# Altium project power_board.PrjPcb (part 5 of 6)

## Sheet SensorsBat.SchDoc
size A4; SheetNumber: 8; SheetTotal: 9
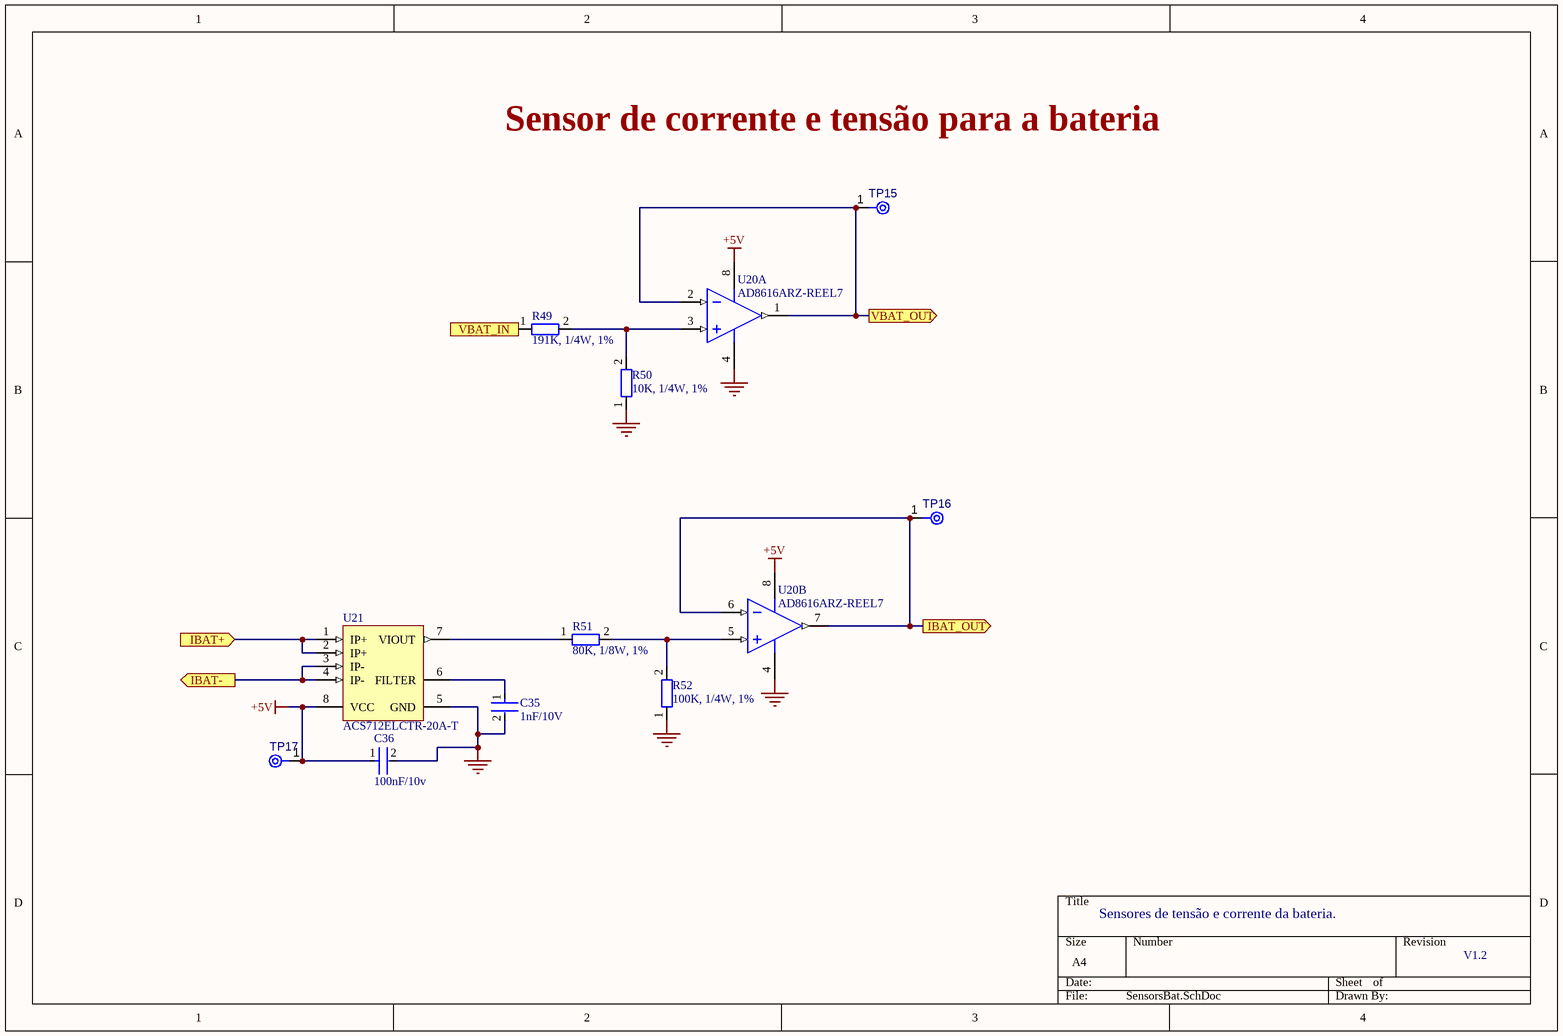
[diagram p6: SensorsBat.SchDoc]

### Parts
C35  1nF/10V  [FP-C0805C-DN-MFG]
C36  100nF/10v  [FP-C0805C-DN-MFG]
R49  191K, 1/4W, 1%  [RESC3216X60N]
R50  10K, 1/4W, 1%  [RES-0805]
R51  80K, 1/8W, 1%  [RES-0805]
R52  100K, 1/4W, 1%  [RES-0805]
TP15  TPAD6R  [TP06R]  (value not drawn)  (no BOM)
TP16  TPAD6R  [TP06R]  (value not drawn)  (no BOM)
TP17  TPAD6R  [TP06R]  (value not drawn)  (no BOM)
U20  AD8616ARZ-REEL7  [ADI-R-8_M]  (parts A,B of 2)
U21  ACS712ELCTR-20A-T  [ALEG-LC-8_V]

### Ports
IBAT+ (in), IBAT- (out), IBAT_OUT (out), VBAT_IN (in), VBAT_OUT (out)

### Nets
+5V: C36.1 TP17.1(TP) U20.8(+V) U21.8(VCC)
+12V: U21.3(IP-) U21.4(IP-) ; port IBAT-
GND: C35.2 C36.2 R50.1 R52.1 U20.4(-V) U21.5(GND)
IBAT: TP16.1(TP) U20.6(-IN_B) U20.7(OUT_B) ; port IBAT_OUT
VBAT: TP15.1(TP) U20.1(OUT_A) U20.2(-IN_A) ; port VBAT_OUT
NetC35_1: C35.1 U21.6(FILTER)
NetL2_2: R49.1 U21.1(IP+) U21.2(IP+) ; port IBAT+, port VBAT_IN
NetR49_2: R49.2 R50.2 U20.3(+IN_A)
NetR51_1: R51.1 U21.7(VIOUT)
NetR51_2: R51.2 R52.2 U20.5(+IN_B)

### Notes on the sheet
- Sensor de corrente e tensão para a bateria
- Sensores de tensão e corrente da bateria.
- V1.2

### Library data of the parts
C35 = CMP-2007-00247-2: CAP CER 1000PF 10V 10% X7R 0805; Manufacturer: KEMET; Manufacturer Part Number: C0805C102K8RACTU; Value: 1,000 pF; Temperature Coefficient: 30ppm/°C; Tolerance: 0.1; Material: Ceramic; ComponentLink2URL: https://content.kemet.com/datasheets/KEM_C1003_C0G_SMD.pdf; Ipc Land Pattern Name: CAPC200125X78; Mouser Description: Multilayer Ceramic Capacitors MLCC - SMD/SMT 10volts 1000pF X7R 10%; Voltage Rating: 10 V; RoHS: TRUE; Temperature Range High: +125°C; Temperature Characteristic: X7R; Digikey Description: CAP CER 1000PF 10V 10% X7R 0805; Lead Free: Yes; Automotive: No; Package: C0805C-DN; Category: Cap; Device Class L2: Capacitors; Temperature: -55°C to +125°C; Temperature Range Low: -55°C; Device Class L3: Ceramic Capacitors; Capacitance: 1,000 pF; ComponentLink2Description: Datasheet; Octopart: https://octopart.com/c0805c102k8ractu-kemet-16783731; Height: 0.88mm; Device Class L1: Passive Components; Supplier 1: Mouser; Supplier Part Number 1: 80-C0805C102K8R; Stock 1: 10223; Pricing 1: 1=0.30000, 10=0.15600, 50=0.15600, 100=0.09300, 1000=0.07300, 10000=0.05100 (USD); Mount: Surface Mount; Case/Package: 0805; Case Code (Metric): 2012; Case Code (Imperial): 0805; Contact Plating: Tin,Matte; Dielectric Material: Ceramic; Min Operating Temperature: -55°C; Max Operating Temperature: 125°C; Packaging: Tape and Reel; Package Quantity: 1; Voltage Rating (DC): 10V; Dielectric: X7R; Termination: SMD/SMT; Series: C; Construction: Flat; Length: 2mm; Width: 0.049inch; Thickness: 0.035inch; REACH SVHC: No SVHC; RoHS Compliant: Yes; ComponentLink1URL: http://www.mouser.com/ds/2/212/KEM_C1002_X7R_SMD-1102033.pdf?src-supplier=Mouser; ComponentLink1Description: http://www.mouser.com/ds/2/212/KEM_C1002_X7R_SMD-1102033.pdf?src-supplier=Mouser; ComponentLink3URL: https://search.kemet.com/component-edge/download/datasheet/C0805C102K8RACTU.pdf?src-supplier=Digi-Key; ComponentLink3Description: https://search.kemet.com/component-edge/download/datasheet/C0805C102K8RACTU.pdf?src-supplier=Digi-Key; ComponentLink4URL: https://api.kemet.com/component-edge/download/datasheet/C0805C102K8RACTU.pdf?src-supplier=Digi-Key; ComponentLink4Description: https://api.kemet.com/component-edge/download/datasheet/C0805C102K8RACTU.pdf?src-supplier=Digi-Key; ComponentLink5URL: http://capacitoredge.kemet.com/capedge2/DataSheet?pn=C0805C102K8RACTU&src-supplier=Avnet; ComponentLink5Description: http://capacitoredge.kemet.com/capedge2/DataSheet?pn=C0805C102K8RACTU&src-supplier=Avnet; ComponentLink6URL: http://www.farnell.com/datasheets/2627200.pdf?src-supplier=Newark; ComponentLink6Description: http://www.farnell.com/datasheets/2627200.pdf?src-supplier=Newark
C36 = CMP-1036-03808-3: CAP CER 10000PF 10V X7R 0805; Manufacturer Part Number: C0805C103K8RACTU; Manufacturer: KEMET; Material: Ceramic; Value: 10,000 pF; Temperature Coefficient: 30ppm/°C; Tolerance: 0.1; RoHS: TRUE; Lead Free: Yes; Temperature: -55°C to +125°C; Device Class L2: Capacitors; Temperature Characteristic: X7R; Device Class L1: Passive Components; Mouser Description: Multilayer Ceramic Capacitors MLCC - SMD/SMT 10volts 10000pF X7R 10%; Category: Cap; Ipc Land Pattern Name: CAPC200125X78; Height: 0.88mm; ComponentLink2URL: https://content.kemet.com/datasheets/KEM_C1003_C0G_SMD.pdf; Capacitance: 10,000 pF; Temperature Range High: +125°C; Automotive: No; ComponentLink2Description: Datasheet; Octopart: https://octopart.com/c0805c103k8ractu-kemet-12595572; Device Class L3: Ceramic Capacitors; Temperature Range Low: -55°C; Package: C0805C-DN; Voltage Rating: 10 V; Digikey Description: CAP CER 10000PF 10V X7R 0805; Supplier 1: Mouser; Supplier Part Number 1: 80-C0805C103K8R; Stock 1: 7669; Pricing 1: 1=0.18000, 10=0.07300, 50=0.07300, 100=0.06000, 1000=0.04500, 10000=0.04500 (USD); Mount: Surface Mount; Case/Package: 0805; Case Code (Metric): 2012; Case Code (Imperial): 0805; Dielectric Material: Ceramic; Min Operating Temperature: -55°C; Max Operating Temperature: 125°C; Packaging: Tape and Reel; Package Quantity: 4000; Voltage Rating (DC): 10V; Dielectric: X7R; Termination: SMD/SMT; Series: C; Length: 2mm; Width: 0.049inch; Thickness: 0.035inch; Lead Pitch: 0.75mm; Depth: 1.25mm; RoHS Compliant: Yes; ComponentLink1URL: https://datasheet.ciiva.com/5422/kem-c1002-x7r-smd-357932-5422870.pdf?src-supplier=Mouser; ComponentLink1Description: https://datasheet.ciiva.com/5422/kem-c1002-x7r-smd-357932-5422870.pdf?src-supplier=Mouser
R49 = RES-1206: Res Thick Film 1206 191K Ohm 1% 0.25W(1/4W) ±100ppm/C Molded SMD Paper T/R; Manufacturer: Yageo; Manufacturer Part Number: RC1206FR-07191KL; Resistance: 191kR; Temperature Coefficient: 100ppm/°C; Power Rating: 250mW; Voltage Rating: 200V; Supplier 1: Mouser; Supplier Part Number 1: 603-RC1206FR-07191KL; RoHS: Yes; Category: Chip SMD Resistors; Stock 1: 10616; Pricing 1: 1=0.23000, 10=0.05400, 50=0.05400, 100=0.01900, 1000=0.01400, 10000=0.00800 (USD); Case/Package: 1206; Contact Plating: Tin,Matte; Case Code (Imperial): 1206; Case Code (Metric): 3216; Weight: 0.000571oz; Min Operating Temperature: -55°C; Max Operating Temperature: 155°C; Tolerance: 1%; Resistor Type: Thick Film; Packaging: Tape and Reel; Termination: SMD/SMT; Voltage Rating (DC): 200V; Features: Moisture Resistant; Series: RC; Max Power Dissipation: 250mW; Number of Terminations: 2; Construction: Rectangular; Length: 3.2mm; Width: 1.6mm; Height: 0.55mm; Depth: 1.6mm; Radiation Hardening: No; Military Standard: Not; Lead Free: Lead Free; RoHS Compliant: Yes; ComponentLink1URL: http://www.mouser.com/ds/2/447/PYu-RC1206_51_RoHS_L-4-349080.pdf?src-supplier=Mouser; ComponentLink1Description: http://www.mouser.com/ds/2/447/PYu-RC1206_51_RoHS_L-4-349080.pdf?src-supplier=Mouser; ComponentLink2URL: http://components.arrow.com/part/dataview/0323_00047427?src-supplier=Arrow+Europe; ComponentLink2Description: http://components.arrow.com/part/dataview/0323_00047427?src-supplier=Arrow+Europe; ComponentLink3URL: http://www.yageo.com/documents/recent/PYu-RC_Group_51_RoHS_L_2.pdf?src-supplier=Avnet; ComponentLink3Description: http://www.yageo.com/documents/recent/PYu-RC_Group_51_RoHS_L_2.pdf?src-supplier=Avnet; ComponentLink4URL: http://www.yageo.com.tw/exep/pages/download/literatures/PYu-R_INT-thick_7.pdf?src-supplier=Digi-Key; ComponentLink4Description: http://www.yageo.com.tw/exep/pages/download/literatures/PYu-R_INT-thick_7.pdf?src-supplier=Digi-Key; ComponentLink5URL: http://www.yageo.com/documents/recent/PYu-RC_Group_51_RoHS_L_9.pdf?src-supplier=Digi-Key; ComponentLink5Description: http://www.yageo.com/documents/recent/PYu-RC_Group_51_RoHS_L_9.pdf?src-supplier=Digi-Key; ComponentLink6URL: http://www.yageo.com/documents/recent/PYu-RC_Group_51_RoHS_L_10.pdf?src-supplier=Digi-Key; ComponentLink6Description: http://www.yageo.com/documents/recent/PYu-RC_Group_51_RoHS_L_10.pdf?src-supplier=Digi-Key; ComponentLink7URL: http://www.yageo.com/documents/recent/PYu-RC1206_51_RoHS_L_5.pdf?src-supplier=Avnet+Europe; ComponentLink7Description: http://www.yageo.com/documents/recent/PYu-RC1206_51_RoHS_L_5.pdf?src-supplier=Avnet+Europe
R50 = Res-0805: Res Thick Film 2.0 x 1.2 mm 10K Ohm 1% 0.125W(1/8W) 100ppm/ C Molded SMD Paper T/R; Manufacturer_Name: YAGEO (PHYCOMP); Manufacturer_Part_Number: RC0805JR-131KL; Manufacturer: Yageo; Manufacturer Part Number: RC0805FR-1310KL; Resistance: 10kR; Temperature Coefficient: 100ppm/°C; Power Rating: 125mW; Voltage Rating: 150V; Datasheet Link: http://www.yageo.com/documents/recent/PYu-RC_Group_51_RoHS_L_10.pdf; Height: 0.6mm; Mouser Part Number: 603-RC0805JR-131KL; Mouser Price/Stock: https://www.mouser.com/Search/Refine.aspx?Keyword=603-RC0805JR-131KL; Supplier 1: Mouser; Supplier Part Number 1: 603-RC0805FR-1310KL; RoHS: Yes; Category: Chip SMD Resistors; Stock 1: 16417; Pricing 1: 1=0.13000, 10=0.03100, 50=0.03100, 100=0.01100, 1000=0.00800, 10000=0.00500 (USD); Case/Package: 0805; Number of Pins: 2; Contact Plating: Tin,Matte,Lead; Case Code (Imperial): 0805; Case Code (Metric): 2012; Min Operating Temperature: -55°C; Max Operating Temperature: 155°C; Tolerance: 1%; Resistor Type: Thick Film; Packaging: Tape and Reel; Termination: SMD/SMT; Voltage Rating (DC): 150V; Series: RC; Resistance Tolerance: 1%; Radiation Hardening: No; REACH SVHC: No SVHC; Lead Free: Lead Free; RoHS Compliant: Yes; ComponentLink1URL: http://www.farnell.com/datasheets/2167052.pdf?src-supplier=Farnell; ComponentLink1Description: http://www.farnell.com/datasheets/2167052.pdf?src-supplier=Farnell; ComponentLink2URL: http://www.mouser.com/ds/2/447/Yageo_08112016_RC0805-968729.pdf?src-supplier=Mouser; ComponentLink2Description: http://www.mouser.com/ds/2/447/Yageo_08112016_RC0805-968729.pdf?src-supplier=Mouser; ComponentLink3URL: http://components.arrow.com/part/dataview/0323_00200993?src-supplier=Arrow+Europe; ComponentLink3Description: http://components.arrow.com/part/dataview/0323_00200993?src-supplier=Arrow+Europe; ComponentLink4URL: http://www.yageo.com/pdf/PYu-RC0805_51_RoHS_L_4.pdf?src-supplier=Avnet; ComponentLink4Description: http://www.yageo.com/pdf/PYu-RC0805_51_RoHS_L_4.pdf?src-supplier=Avnet; ComponentLink5URL: http://www.yageo.com/documents/recent/PYu-RC0805_51_RoHS_L_5.pdf?src-supplier=Avnet+Europe; ComponentLink5Description: http://www.yageo.com/documents/recent/PYu-RC0805_51_RoHS_L_5.pdf?src-supplier=Avnet+Europe; ComponentLink6URL: http://www.farnell.com/datasheets/2167052.pdf?src-supplier=Element14; ComponentLink6Description: http://www.farnell.com/datasheets/2167052.pdf?src-supplier=Element14; ComponentLink7URL: http://www.farnell.com/datasheets/2167052.pdf?src-supplier=Newark; ComponentLink7Description: http://www.farnell.com/datasheets/2167052.pdf?src-supplier=Newark
R51 = Res-0805: RES SMD 80.6K OHM 1% 1/8W 0805; Manufacturer_Name: YAGEO (PHYCOMP); Manufacturer_Part_Number: RC0805JR-131KL; Manufacturer: Yageo; Manufacturer Part Number: RC0805FR-0780K6L; Resistance: 80.6kR; Power Rating: 125mW; Voltage Rating: 150V; Temperature Coefficient: 100ppm/°C; Datasheet Link: http://www.yageo.com/documents/recent/PYu-RC_Group_51_RoHS_L_10.pdf; Height: 0.6mm; Mouser Part Number: 603-RC0805JR-131KL; Mouser Price/Stock: https://www.mouser.com/Search/Refine.aspx?Keyword=603-RC0805JR-131KL; Supplier 1: Mouser; Supplier Part Number 1: 603-RC0805FR-0780K6L; RoHS: Yes; Category: Chip SMD Resistors; Stock 1: 25105; Pricing 1: 1=0.13000, 10=0.03100, 50=0.03100, 100=0.01100, 1000=0.00800, 10000=0.00500 (USD); Mount: Surface Mount; Case/Package: 0805; Case Code (Metric): 2012; Case Code (Imperial): 0805; Size Code: 0805; Min Operating Temperature: -55°C; Max Operating Temperature: 155°C; Tolerance: 1%; Package Quantity: 1; Packaging: Tape and Reel; Resistor Type: Thick Film; Number of Terminations: 2; Termination: SMD/SMT; Max Power Dissipation: 125mW; Voltage Rating (DC): 150V; Features: Moisture Resistant; Series: RC; Technology: THICK FILM; Length: 0.079inch; Width: 0.049inch; Depth: 1.25mm; Lead Free: Lead Free; RoHS Compliant: Yes; ComponentLink1URL: https://datasheet.ciiva.com/11819/0900766b8106beab-11819866.pdf?src-supplier=RSComponents; ComponentLink1Description: https://datasheet.ciiva.com/11819/0900766b8106beab-11819866.pdf?src-supplier=RSComponents; ComponentLink2URL: https://datasheet.ciiva.com/2457/pyu-r-int-thick-7-2457257.pdf?src-supplier=Digi-Key; ComponentLink2Description: https://datasheet.ciiva.com/2457/pyu-r-int-thick-7-2457257.pdf?src-supplier=Digi-Key; ComponentLink3URL: https://datasheet.ciiva.com/2457/pyu-r-int-thick-7-2457258.pdf?src-supplier=Digi-Key; ComponentLink3Description: https://datasheet.ciiva.com/2457/pyu-r-int-thick-7-2457258.pdf?src-supplier=Digi-Key; ComponentLink4URL: https://datasheet.ciiva.com/2457/pyu-r-int-thick-7-2457259.pdf?src-supplier=Digi-Key; ComponentLink4Description: https://datasheet.ciiva.com/2457/pyu-r-int-thick-7-2457259.pdf?src-supplier=Digi-Key; ComponentLink5URL: https://datasheet.ciiva.com/12667/rc0805-12667964.pdf?src-supplier=Mouser; ComponentLink5Description: https://datasheet.ciiva.com/12667/rc0805-12667964.pdf?src-supplier=Mouser
R52 = Res-0805: Thick Film Resistors 100K OHM 1%; Manufacturer_Name: YAGEO (PHYCOMP); Manufacturer_Part_Number: RC0805JR-131KL; Manufacturer: Yageo; Manufacturer Part Number: RC0805FR-13100KL; Resistance: 100kR; Temperature Coefficient: 100ppm/°C; Power Rating: 125mW; Voltage Rating: 150V; Datasheet Link: http://www.yageo.com/documents/recent/PYu-RC_Group_51_RoHS_L_10.pdf; Height: 0.6mm; Mouser Part Number: 603-RC0805JR-131KL; Mouser Price/Stock: https://www.mouser.com/Search/Refine.aspx?Keyword=603-RC0805JR-131KL; Supplier 1: Mouser; Supplier Part Number 1: 603-RC0805FR-13100KL; RoHS: Yes; Category: Chip SMD Resistors; Stock 1: 57591; Pricing 1: 1=0.13000, 10=0.03100, 50=0.03100, 100=0.01100, 1000=0.00800, 10000=0.00500 (USD); Case/Package: 0805; Contact Plating: Tin,Lead,Matte; Case Code (Imperial): 0805; Case Code (Metric): 2012; Size Code: 0805; Min Operating Temperature: -55°C; Max Operating Temperature: 155°C; Tolerance: 1%; Resistor Type: Thick Film; Packaging: Tape and Reel; Termination: SMD/SMT; Series: RC; Radiation Hardening: No; Lead Free: Lead Free; RoHS Compliant: Yes; ComponentLink1URL: https://datasheet.ciiva.com/5558/rc0805-5558047.pdf?src-supplier=Mouser; ComponentLink1Description: https://datasheet.ciiva.com/5558/rc0805-5558047.pdf?src-supplier=Mouser
TP15-TP17 = CMP-00028-00002-2: 0.6mm round; Pins: 1
U20 = CMP-0384-00618-1: Double Channel Wide Bandwidth Operational Amplifier, 24 MHz BW, 12 V/us SR, Industrial, 8-pin SOIC (R-8), Reel; Generic Part Number: AD8616; Manufacturer: Analog Devices; Amplifiers Per Package: 2; Iq/Amp: 2mA; Small Signal Bandwidth: 24MHz; V Span Max: 6V; Input Offset Voltage: 23uV; Input Bias Current: 200fA; V Span Min: 2.7V; Slew Rate: 12V/us; ComponentLink2Description: Datasheet; ComponentLink1URL: http://www.analog.com/en/index.html; PackageDescription: 8-Pin Standard Small Outline Package, Body 3.9 x 4.9 mm, Pitch 1.27 mm; Code_JEDEC: MS-012-AA; PackageReference: R-8; Mounting Technology: Surface Mount; ComponentLink2URL: http://www.analog.com/static/imported-files/data_sheets/AD8615_8616_8618.pdf; ComponentLink3Description: Package Specification; PackageVersion: 060506-A; ComponentLink1Description: Manufacturer URL; ComponentLink3URL: http://www.analog.com/static/imported-files/packages/PKG_PDF/SOIC_Narrow%20(R)/R_8.pdf; DatasheetVersion: Rev. E; PartNumber: AD8616ARZ-REEL7
U21 = CMP-0826-00001-1: Linear Current Sensor IC, 4.5 to 5.5 V Supply Voltage, 10 mA Supply Current, -40 to 85 degC, 8-Pin SOIC (LC), RoHS, Tape and Reel; Manufacturer: Allegro Microsystems; CLOAD: 10 nF Max.; ICC: 10 mA; F: 80 kHz; RLOAD: 4.7 kOhm Min.; Optimized Accuracy Range: +/- 20 A; TR: 3.5 us; Sensitivity Sens: 100 mV/A Typ.; Operating Temperature Range: -40 to 85 degC; ComponentLink2URL: http://www.allegromicro.com/~/media/Files/Datasheets/ACS712-Datasheet.ashx; ComponentLink1Description: Manufacturer URL; VCC: 4.5 to 5.5 V; Mounting Technology: Surface Mount; DatasheetVersion: Rev. 15; ComponentLink2Description: Datasheet; ComponentLink1URL: http://www.allegromicro.com/; PackageDescription: 8-Pin SOIC, Body 4.9 x 3.9 mm, Pitch 1.27 mm; PackageReference: LC-8; RoHS: TRUE; Packing: Tape and Reel; PartNumber: ACS712ELCTR-20A-T

## Sheet charge_controller.SchDoc
size A4; SheetNumber: 4; SheetTotal: 9
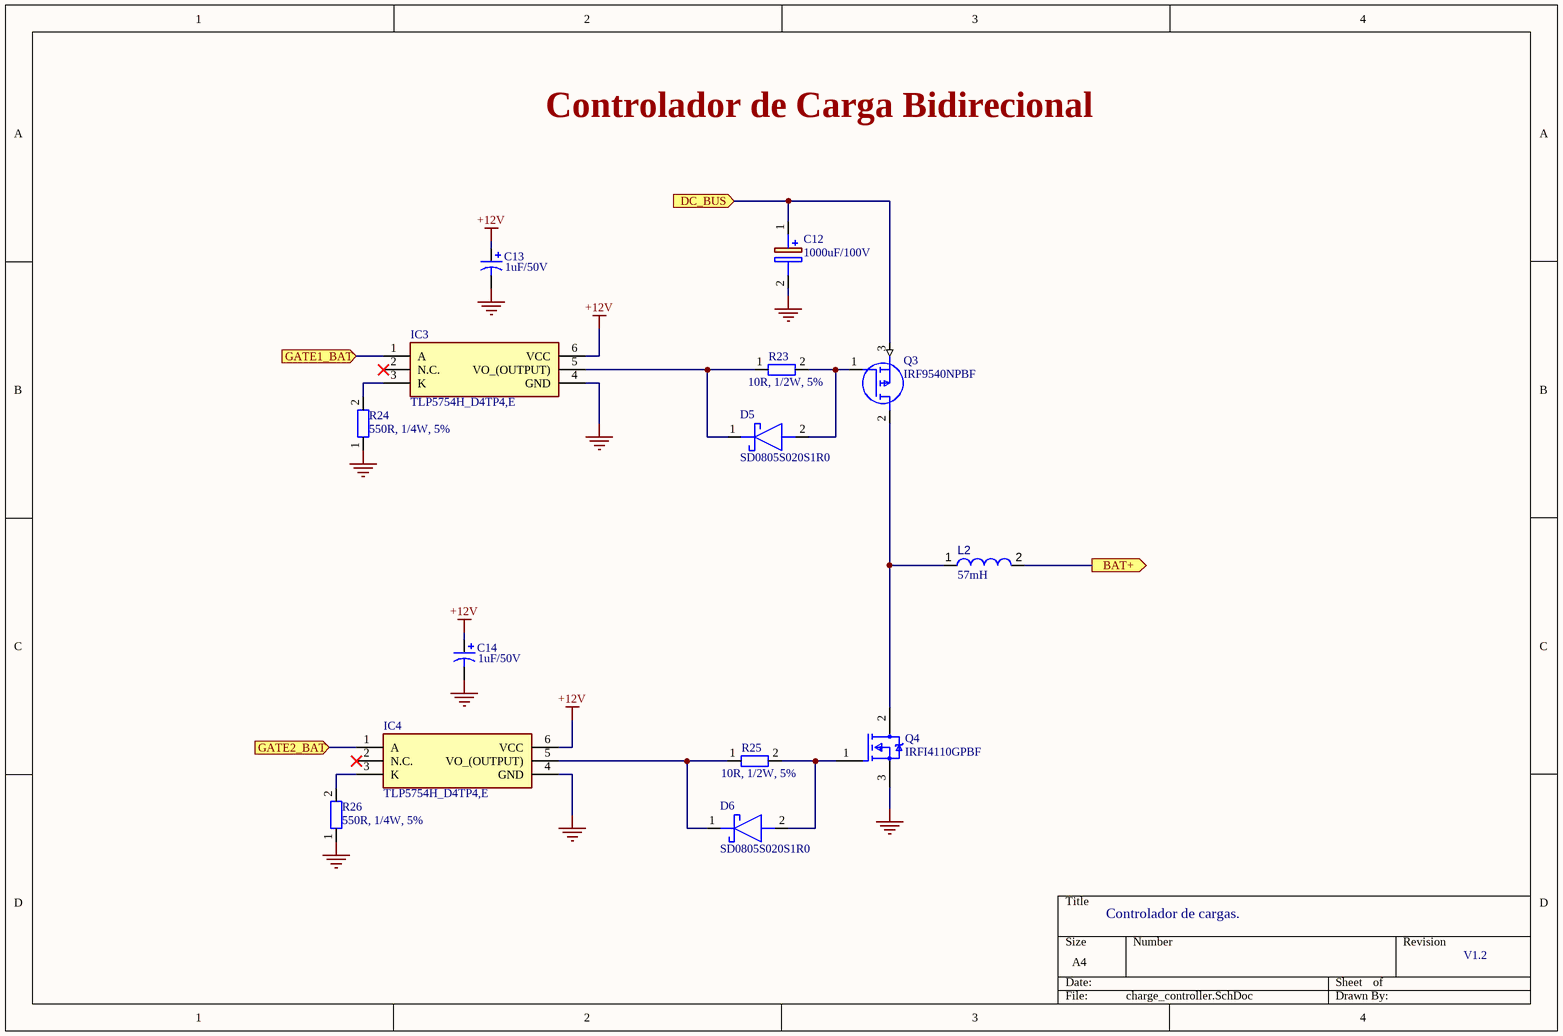
[diagram p7: charge_controller.SchDoc]

### Parts
C12  1000uF/100V  [CAPPRD750W85D1800H3750]
C13  value 1uF/50V  [C1206]  (hidden comment: Cap Pol1)
C14  value 1uF/50V  [C1206]  (hidden comment: Cap Pol1)
D5  SD0805S020S1R0  [DIOM1613X100N]
D6  SD0805S020S1R0  [DIOM1613X100N]
IC3  TLP5754H_D4TP4,E  [SOIC127P1105X230-6N]
IC4  TLP5754H_D4TP4,E  [SOIC127P1105X230-6N]
L2  value 57mH  [INDR62-500-1100X850X1100]  (hidden comment: RL622-101K-RC)
Q3  IRF9540NPBF  [TO254P469X1042X1967-3P]
Q4  IRFI4110GPBF  [FP-PG-TO220-3-MFG]
R23  10R, 1/2W, 5%  [RES-0805]
R24  550R, 1/4W, 5%  [RES-0805]
R25  10R, 1/2W, 5%  [RES-0805]
R26  550R, 1/4W, 5%  [RES-0805]

### Ports
BAT+ (out), DC_BUS (in), GATE1_BAT (in), GATE2_BAT (in)

### Nets
+12V: C13.1 C14.1 IC3.6(VCC) IC4.6(VCC)
GND: C12.2(-) C13.2 C14.2 IC3.4(GND) IC4.4(GND) Q4.3(SOURCE) R24.1 R26.1
DC BUS: C12.1(+) Q3.3(S) ; port DC_BUS
NetD5_1: D5.1(K) IC3.5(VO_(OUTPUT)) R23.1
NetD5_2: D5.2(A) Q3.1(G) R23.2
NetD6_1: D6.1(K) IC4.5(VO_(OUTPUT)) R25.1
NetD6_2: D6.2(A) Q4.1(GATE) R25.2
NetIC3_1: IC3.1(A) ; port GATE1_BAT
NetIC3_3: IC3.3(K) R24.2
NetIC4_1: IC4.1(A) ; port GATE2_BAT
NetIC4_3: IC4.3(K) R26.2
NetL2_1: L2.1 Q3.2(D) Q4.2(DRAIN)
NetL2_2: L2.2 ; port BAT+

Not connected (* = marked no-connect by the designer): IC3 2(N.C.)*; IC4 2(N.C.)*

### Notes on the sheet
- Controlador de Carga Bidirecional
- Controlador de cargas.
- V1.2

### Library data of the parts
C12 = ECA-2AHG102: Aluminum Electrolytic Capacitors - Leaded 1000uF 100V; Manufacturer_Name: Panasonic; Capacitance: 1mF; Tolerance: 20%; Ripple Current: 985mA; Leakage Current: 3uA; Life (Hours): 2000Hour; Dissipation Factor: 0.08%; Lead/Base Style: Straight; Lead Diameter: 0.8mm; Datasheet Link: http://www.mouser.com/ds/2/315/ABA0000C1215-1109177.pdf; Height: 37.5mm; Manufacturer_Part_Number: ECA-2AHG102; Mouser Part Number: 667-ECA-2AHG102; Mouser Price/Stock: https://www.mouser.co.uk/ProductDetail/Panasonic/ECA-2AHG102/?qs=rrcJgg%2Fw9KxYcZZHtVYgiQ%3D%3D; Arrow Part Number: ECA-2AHG102; Arrow Price/Stock: https://www.arrow.com/en/products/eca-2ahg102/panasonic; Supplier 1: Mouser; Supplier Part Number 1: 667-ECA-2AHG102; Manufacturer: Panasonic; Manufacturer Part Number: ECA-2AHG102; RoHS: Yes; Category: Aluminum Electrolytic Capacitors; Stock 1: 994; Pricing 1: 1=2.62000, 10=1.75000, 50=1.75000, 100=1.60000, 1000=1.07000, 10000=1.07000 (USD); Mount: Through Hole,PCB; Case/Package: Radial; Number of Pins: 2; Contact Plating: Tin; Min Operating Temperature: -55°C; Max Operating Temperature: 105°C; Termination: Radial; Voltage Rating: 100V; Packaging: Bulk; Package Quantity: 50; Voltage Rating (DC): 100V; Voltage: 100V; Series: NHG; Construction: RADIAL; Diameter: 18mm; Length: 35.5mm; Width: 18mm; Lead Pitch: 7.5mm; Height - Seated (Max): 1.476inch; Radiation Hardening: No; REACH SVHC: No SVHC; Lead Free: Lead Free; RoHS Compliant: Yes; ComponentLink1URL: https://datasheet.ciiva.com/2984/aba0000ce26-2984390.pdf?src-supplier=Avnet; ComponentLink1Description: https://datasheet.ciiva.com/2984/aba0000ce26-2984390.pdf?src-supplier=Avnet; ComponentLink2URL: https://datasheet.ciiva.com/43459/1790596-43459676.pdf?src-supplier=Farnell; ComponentLink2Description: https://datasheet.ciiva.com/43459/1790596-43459676.pdf?src-supplier=Farnell; ComponentLink3URL: https://datasheet.ciiva.com/24027/aba0000ce26-372437-24027279.pdf?src-supplier=Mouser; ComponentLink3Description: https://datasheet.ciiva.com/24027/aba0000ce26-372437-24027279.pdf?src-supplier=Mouser; ComponentLink4URL: https://datasheet.ciiva.com/30158/8aba0000ce26-30158524.pdf?src-supplier=Onlinecomponents.com; ComponentLink4Description: https://datasheet.ciiva.com/30158/8aba0000ce26-30158524.pdf?src-supplier=Onlinecomponents.com; ComponentLink5URL: https://datasheet.ciiva.com/16387/aba0000ce26-16387053.pdf?src-supplier=Future+Electronics; ComponentLink5Description: https://datasheet.ciiva.com/16387/aba0000ce26-16387053.pdf?src-supplier=Future+Electronics; ComponentLink6URL: https://datasheet.ciiva.com/14594/70067776-14594090.pdf?src-supplier=Allied+Electronics; ComponentLink6Description: https://datasheet.ciiva.com/14594/70067776-14594090.pdf?src-supplier=Allied+Electronics; ComponentLink7URL: https://datasheet.ciiva.com/15198/getdatasheetpartid-470872-15198006.pdf?src-supplier=Verical; ComponentLink7Description: https://datasheet.ciiva.com/15198/getdatasheetpartid-470872-15198006.pdf?src-supplier=Verical; ComponentLink8URL: https://datasheet.ciiva.com/17533/aba0000ce26-17533421.pdf?src-supplier=Avnet+Europe; ComponentLink8Description: https://datasheet.ciiva.com/17533/aba0000ce26-17533421.pdf?src-supplier=Avnet+Europe; ComponentLink9URL: https://datasheet.ciiva.com/29248/792491-da-01-en-elko-nhg-r-1000uf-100v-105c-29248620.pdf?src-supplier=Conrad; ComponentLink9Description: https://datasheet.ciiva.com/29248/792491-da-01-en-elko-nhg-r-1000uf-100v-105c-29248620.pdf?src-supplier=Conrad
C13 C14 = Cap Pol1: KEMET         T491A105K050AT            Surface Mount Tantalum Capacitor, T491 Series, 1 F,  10%, 50 V, 1206 [3216 Metric], A; Capacitance: 1uF; ESR (Equivalent Series Resistance): 7R; Voltage Rating: 50V; Polarity: Polar; Dissipation Factor: 4%; Published: 8-Jun-2000; LatestRevisionDate: 17-Jul-2002; LatestRevisionNote: Re-released for DXP Platform.; PackageReference: RB7.6-15; Publisher: Altium Limited; PackageDescription: Polarized Capacitor (Radial); 2 Leads; Supplier 1: Mouser; Supplier Part Number 1: 80-T491A105K050AT; Manufacturer: KEMET; Manufacturer Part Number: T491A105K050AT; RoHS: Yes; Category: Tantalum Capacitors; Stock 1: 5526; Pricing 1: 1=0.86000, 10=0.53600, 50=0.53600, 100=0.37800, 1000=0.31600, 10000=0.24700 (USD); Case/Package: Molded; Case Code (Metric): 3216; Case Code (Imperial): 1206; Min Operating Temperature: -55°C; Max Operating Temperature: 125°C; Tolerance: 10%; Packaging: Cut Tape; Voltage Rating (DC): 50V; Length: 3.2mm; Depth: 1.6mm; REACH SVHC: No SVHC; Lead Free: Lead Free; RoHS Compliant: Yes; ComponentLink1URL: https://datasheet.ciiva.com/7972/1854511-7972911.pdf?src-supplier=Element14; ComponentLink1Description: https://datasheet.ciiva.com/7972/1854511-7972911.pdf?src-supplier=Element14
D5 D6 = SD0805S020S1R0: Schottky Diodes & Rectifiers 20volts 1A SIZE 0805; Manufacturer_Name: AVX; Manufacturer: Kyocera AVX; Max Surge Current: 10A; Forward Voltage: 450mV; Max Reverse Current: 200uA; Max Repetitive Reverse Voltage (Vrrm): 20V; Element Configuration: Single; Datasheet Link: https://componentsearchengine.com/Datasheets/1/SD0805S020S1R0.pdf; Height: 1mm; Manufacturer_Part_Number: SD0805S020S1R0; Mouser Part Number: 581-SD0805S020S1R0; Mouser Price/Stock: https://www.mouser.co.uk/ProductDetail/AVX/SD0805S020S1R0/?qs=jCA%252BPfw4LHbpkAoSnwrdjw%3D%3D; Arrow Part Number: SD0805S020S1R0; Arrow Price/Stock: https://www.arrow.com/en/products/sd0805s020s1r0/avx; Supplier 1: Mouser; Supplier Part Number 1: 581-SD0805S020S1R0; Manufacturer Part Number: SD0805S020S1R0; RoHS: Yes; Category: Rectifier Diodes; Stock 1: 14821; Pricing 1: 1=0.38000, 10=0.29100, 50=0.29100, 100=0.17800, 1000=0.11300, 10000=0.08700 (USD); Mount: Surface Mount; Case/Package: 0805; Number of Pins: 2; Case Code (Metric): 2012; Case Code (Imperial): 0805; Min Operating Temperature: -55°C; Max Operating Temperature: 125°C; Packaging: Tape and Reel; Package Quantity: 3000; Forward Current: 1A; Average Rectified Current: 1A; Max Reverse Leakage Current: 200uA; Max Forward Surge Current (Ifsm): 10A; Peak Non-Repetitive Surge Current: 10A; Max Reverse Voltage (DC): 20V; Series: -; Radiation Hardening: No; REACH SVHC: No SVHC; RoHS Compliant: Yes; ComponentLink1URL: https://datasheet.ciiva.com/29883/schottky-29883740.pdf?src-supplier=Avnet; ComponentLink1Description: https://datasheet.ciiva.com/29883/schottky-29883740.pdf?src-supplier=Avnet; ComponentLink2URL: https://datasheet.ciiva.com/29883/schottky-29883741.pdf?src-supplier=Avnet; ComponentLink2Description: https://datasheet.ciiva.com/29883/schottky-29883741.pdf?src-supplier=Avnet; ComponentLink3URL: https://datasheet.ciiva.com/13084/schottky-221155-13084174.pdf?src-supplier=Mouser; ComponentLink3Description: https://datasheet.ciiva.com/13084/schottky-221155-13084174.pdf?src-supplier=Mouser
IC3 IC4 = TLP5754H_D4TP4,E: Integrated Circuit; Manufacturer_Name: Toshiba; Manufacturer_Part_Number: TLP5754H(D4TP4,E; Datasheet Link: https://toshiba.semicon-storage.com/; Height: 2.3mm; Mouser Part Number: 757-TLP5754HD4TP4E; Mouser Price/Stock: https://www.mouser.co.uk/ProductDetail/Toshiba/TLP5754HD4TP4E?qs=BJlw7L4Cy78tX5u9MwNqOg%3D%3D; Supplier 1: Mouser; Supplier Part Number 1: 757-TLP5754HD4TP4E; Manufacturer: Toshiba; Manufacturer Part Number: TLP5754H(D4TP4,E; RoHS: Yes; Stock 1: 2749; Pricing 1: 1=2.13000, 10=1.86000, 50=1.83000, 100=1.09000, 1000=0.95600, 10000=0.73200 (USD)
L2 = CMP-006-00013-6: Radial Inductor, 100 uH, +/- 10%, 0.91 A, -55 to 105 degC, 2-Pin THD, RoHS, Bulk; Manufacturer: Bourns; Q Factor: 20; Shielding: Unshielded; Core Material: Ferrite; Self Resonant Frequency: 3.7MHz; Resistance: 0.28Ohm; Current Rating: 910mA; Datasheet URL: http://www.bourns.com/docs/Product-Datasheets/rl622_series.pdf; Pins: 2; Inductance Tolerance: 10%; Packaging: Bulk; Tolerance: 10%; Diameter: 8.5mm; RoHS Compliant: True; Max Operating Temperature: 105°C; Package Quantity: 100; Package Reference: INDR62-500-1100X850X1100; Mounting Technology: TH; Lead Pitch: 5mm; Datasheet Version: Aug-10; Min Operating Temperature: -55°C; Package Description: 2-Pin Radial Lead, Dia 8.5 mm, Pitch 5 mm; Case/Package: Radial
Q3 = IRF9540NPBF: Mosfet, Power; P-ch; Vdss -100V; Rds(on) 0.117 Ohm; Id -23A; TO-220AB; Pd 140W; Vgs +/-2; Manufacturer_Name: Infineon; Manufacturer: International Rectifier; Rise Time: 67ns; Gate to Source Voltage (Vgs): 20V; Continuous Drain Current (ID): 23A; Turn-On Delay Time: 15ns; Turn-Off Delay Time: 51ns; Rds On Max: 117mR; Input Capacitance: 1.3nF; Drain to Source Voltage (Vdss): 100V; Element Configuration: Single; Recovery Time: 220ns; Nominal Vgs: -4V; Number of Elements: 1; Datasheet Link: https://www.infineon.com/dgdl/irf9540npbf.pdf?fileId=5546d462533600a401535611cfa21dc8; Height: 4.69mm; Manufacturer_Part_Number: IRF9540NPBF; Mouser Part Number: 942-IRF9540NPBF; Mouser Price/Stock: https://www.mouser.co.uk/ProductDetail/Infineon-IR/IRF9540NPBF?qs=9%252BKlkBgLFf0vnuA8mxUPtw%3D%3D; Arrow Part Number: IRF9540NPBF; Arrow Price/Stock: https://www.arrow.com/en/products/irf9540npbf/infineon-technologies-ag; Supplier 1: Mouser; Supplier Part Number 1: 942-IRF9540NPBF; Manufacturer Part Number: IRF9540NPBF; RoHS: Yes; Category: MOSFETs; Stock 1: 1219; Pricing 1: 1=1.17000, 10=0.96200, 50=0.96200, 100=0.74900, 1000=0.51600, 10000=0.45300 (USD); Mount: Through Hole; Case/Package: TO-220AB; Number of Pins: 3; Min Operating Temperature: -55°C; Max Operating Temperature: 175°C; Packaging: Rail/Tube; Max Power Dissipation: 140W; Power Dissipation: 140W; Drain to Source Resistance: 117mR; Drain to Source Breakdown Voltage: -100V; Package Quantity: 50; Dual Supply Voltage: -100V; Fall Time: 51ns; On-State Resistance: 117mR; Termination: Through Hole; Voltage Rating (DC): -100V; Current Rating: -23A; Series: HEXFET®; Drain-source On Resistance-Max: 117mR; Length: 10.54mm; Width: 4.69mm; Lead Pitch: 2.54mm; Radiation Hardening: No; REACH SVHC: No SVHC; Lead Free: Lead Free; RoHS Compliant: Yes; ComponentLink1URL: https://datasheet.ciiva.com/7333/irf9540n-7333105.pdf?src-supplier=Newark; ComponentLink1Description: https://datasheet.ciiva.com/7333/irf9540n-7333105.pdf?src-supplier=Newark; ComponentLink2URL: https://datasheet.ciiva.com/19479/1561555-19479734.pdf?src-supplier=Jameco; ComponentLink2Description: https://datasheet.ciiva.com/19479/1561555-19479734.pdf?src-supplier=Jameco; ComponentLink3URL: https://datasheet.ciiva.com/7835/irf9540n-7835622.pdf?src-supplier=Element14; ComponentLink3Description: https://datasheet.ciiva.com/7835/irf9540n-7835622.pdf?src-supplier=Element14
Q4 = CMP-32901-000277-1: MOSFET N-CH 100V 72A TO220AB; Manufacturer: Infineon; Rds On Max: 4.5mR; Threshold Voltage: 4V; Input Capacitance: 9.54nF; Max Power Dissipation: 61W; Case/Package: TO-220-3; Min Operating Temperature: -55°C; Lead Free: Lead Free; Mount: Through Hole; RoHS Compliant: Yes; Halogen Free: Halogen Free; Packaging: Rail/Tube; Max Operating Temperature: 175°C; Continuous Drain Current (ID): 72A; Drain to Source Voltage (Vdss): 100V; REACH SVHC: No SVHC; Max Dual Supply Voltage: 100V; Number of Pins: 3; Supplier 1: Mouser; Supplier Part Number 1: 942-IRFI4110GPBF; Manufacturer Part Number: IRFI4110GPBF; RoHS: Yes; Category: MOSFETs; Stock 1: 1795; Pricing 1: 1=3.31000, 10=2.79000, 50=2.63000, 100=2.25000, 1000=1.72000, 10000=1.59000 (USD); ComponentLink1URL: http://www.infineon.com/dgdl/irfi4110gpbf.pdf?fileId=5546d462533600a401535623f28d1f78&src-supplier=Digi-Key; ComponentLink1Description: http://www.infineon.com/dgdl/irfi4110gpbf.pdf?fileId=5546d462533600a401535623f28d1f78&src-supplier=Digi-Key; ComponentLink2URL: http://www.farnell.com/datasheets/1302157.pdf?src-supplier=Element14; ComponentLink2Description: http://www.farnell.com/datasheets/1302157.pdf?src-supplier=Element14
R23 R25 = Res-0805: Res Thick Film 2512 10 Ohm 5% 1W 200ppm/C Molded SMD SMD Blister T/R; Manufacturer_Name: YAGEO (PHYCOMP); Manufacturer_Part_Number: RC0805JR-131KL; Manufacturer: Vishay Dale; Manufacturer Part Number: CRCW251210R0JNEG; Voltage Rating: 500V; Temperature Coefficient: 200ppm/°C; Datasheet Link: http://www.yageo.com/documents/recent/PYu-RC_Group_51_RoHS_L_10.pdf; Height: 0.6mm; Mouser Part Number: 603-RC0805JR-131KL; Mouser Price/Stock: https://www.mouser.com/Search/Refine.aspx?Keyword=603-RC0805JR-131KL; Supplier 1: Digi-Key; Supplier Part Number 1: 541-10XCT-ND; RoHS: Yes; Category: Chip SMD Resistors; Stock 1: 12153; Pricing 1: 1=0.37000, 10=0.31600, 100=0.12360, 1000=0.05175 (USD); Mount: Surface Mount; Case/Package: 2512; Number of Pins: 2; Weight: 0.001429oz; Case Code (Metric): 6432; Case Code (Imperial): 2512; Contact Plating: Tin; Size Code: 2512; Min Operating Temperature: -55°C; Max Operating Temperature: 155°C; Packaging: Tape and Reel; Resistance: 10R; Tolerance: 5%; Power Rating: 1W; Package Quantity: 1; Resistor Type: Thick Film; Number of Terminations: 2; Termination: SMD/SMT; Max Power Dissipation: 1W; Voltage Rating (DC): 500V; Features: Automotive AEC-Q200; Series: CRCW; Resistance Tolerance: 5%; Construction: Rectangular; Length: 6.3mm; Width: 0.124inch; Depth: 3.15mm; Radiation Hardening: No; REACH SVHC: Unknown; Military Standard: Not; Lead Free: Lead Free; RoHS Compliant: Yes; ComponentLink1URL: https://datasheet.ciiva.com/15159/getdatasheetpartid-91246-15159904.pdf?src-supplier=Verical; ComponentLink1Description: https://datasheet.ciiva.com/15159/getdatasheetpartid-91246-15159904.pdf?src-supplier=Verical; ComponentLink2URL: https://datasheet.ciiva.com/2478/dcrcwe3-2478572.pdf?src-supplier=Digi-Key; ComponentLink2Description: https://datasheet.ciiva.com/2478/dcrcwe3-2478572.pdf?src-supplier=Digi-Key; ComponentLink3URL: https://datasheet.ciiva.com/2478/dcrcwe3-2478573.pdf?src-supplier=Digi-Key; ComponentLink3Description: https://datasheet.ciiva.com/2478/dcrcwe3-2478573.pdf?src-supplier=Digi-Key; ComponentLink4URL: https://datasheet.ciiva.com/2478/dcrcwe3-2478574.pdf?src-supplier=Digi-Key; ComponentLink4Description: https://datasheet.ciiva.com/2478/dcrcwe3-2478574.pdf?src-supplier=Digi-Key; ComponentLink5URL: https://datasheet.ciiva.com/9050/dcrcwe3-9050715.pdf?src-supplier=Avnet; ComponentLink5Description: https://datasheet.ciiva.com/9050/dcrcwe3-9050715.pdf?src-supplier=Avnet; ComponentLink6URL: https://datasheet.ciiva.com/5550/dcrcwe3-109170-5550302.pdf?src-supplier=Mouser; ComponentLink6Description: https://datasheet.ciiva.com/5550/dcrcwe3-109170-5550302.pdf?src-supplier=Mouser; ComponentLink7URL: https://datasheet.ciiva.com/17189/dcrcwe3-17189736.pdf?src-supplier=Avnet+Europe; ComponentLink7Description: https://datasheet.ciiva.com/17189/dcrcwe3-17189736.pdf?src-supplier=Avnet+Europe; ComponentLink8URL: https://datasheet.ciiva.com/22870/70201119-22870670.pdf?src-supplier=Allied+Electronics; ComponentLink8Description: https://datasheet.ciiva.com/22870/70201119-22870670.pdf?src-supplier=Allied+Electronics; ComponentLink9URL: https://datasheet.ciiva.com/16381/dcrcwe3-16381399.pdf?src-supplier=Future+Electronics; ComponentLink9Description: https://datasheet.ciiva.com/16381/dcrcwe3-16381399.pdf?src-supplier=Future+Electronics; ComponentLink10URL: https://datasheet.ciiva.com/16770/70201119-16770621.pdf?src-supplier=Allied+Electronics; ComponentLink10Description: https://datasheet.ciiva.com/16770/70201119-16770621.pdf?src-supplier=Allied+Electronics
R24 R26 = Res-0805: RES SMD 560 MOHM 5% 1/8W 0805; Manufacturer_Name: YAGEO (PHYCOMP); Manufacturer_Part_Number: RC0805JR-131KL; Manufacturer: Yageo; Manufacturer Part Number: RL0805JR-070R56L; Resistance: 560mR; Power Rating: 250mW; Temperature Coefficient: 200ppm/°C; Max Power Dissipation: 125mW; Datasheet Link: http://www.yageo.com/documents/recent/PYu-RC_Group_51_RoHS_L_10.pdf; Height: 0.6mm; Mouser Part Number: 603-RC0805JR-131KL; Mouser Price/Stock: https://www.mouser.com/Search/Refine.aspx?Keyword=603-RC0805JR-131KL; Supplier 1: Mouser; Supplier Part Number 1: 603-RL0805JR-070R56L; RoHS: Yes; Category: Chip SMD Resistors; Stock 1: 3106; Pricing 1: 1=0.20000, 10=0.12500, 50=0.12500, 100=0.04000, 1000=0.02800, 10000=0.02500 (USD); Case/Package: 0805; Case Code (Imperial): 0805; Case Code (Metric): 2012; Weight: 0.000194oz; Min Operating Temperature: -55°C; Max Operating Temperature: 155°C; Packaging: Tape and Reel; Tolerance: 5%; Termination: SMD/SMT; Package Quantity: 5000; Features: Moisture Resistant,Automotive AEC-Q200; Series: RL; Technology: THICK FILM; Number of Terminations: 2; Length: 2mm; Width: 1.2mm; RoHS Compliant: Yes; ComponentLink1URL: https://datasheet.ciiva.com/15329/pyu-rl-521-rohs-l-5-15329116.pdf?src-supplier=Mouser; ComponentLink1Description: https://datasheet.ciiva.com/15329/pyu-rl-521-rohs-l-5-15329116.pdf?src-supplier=Mouser